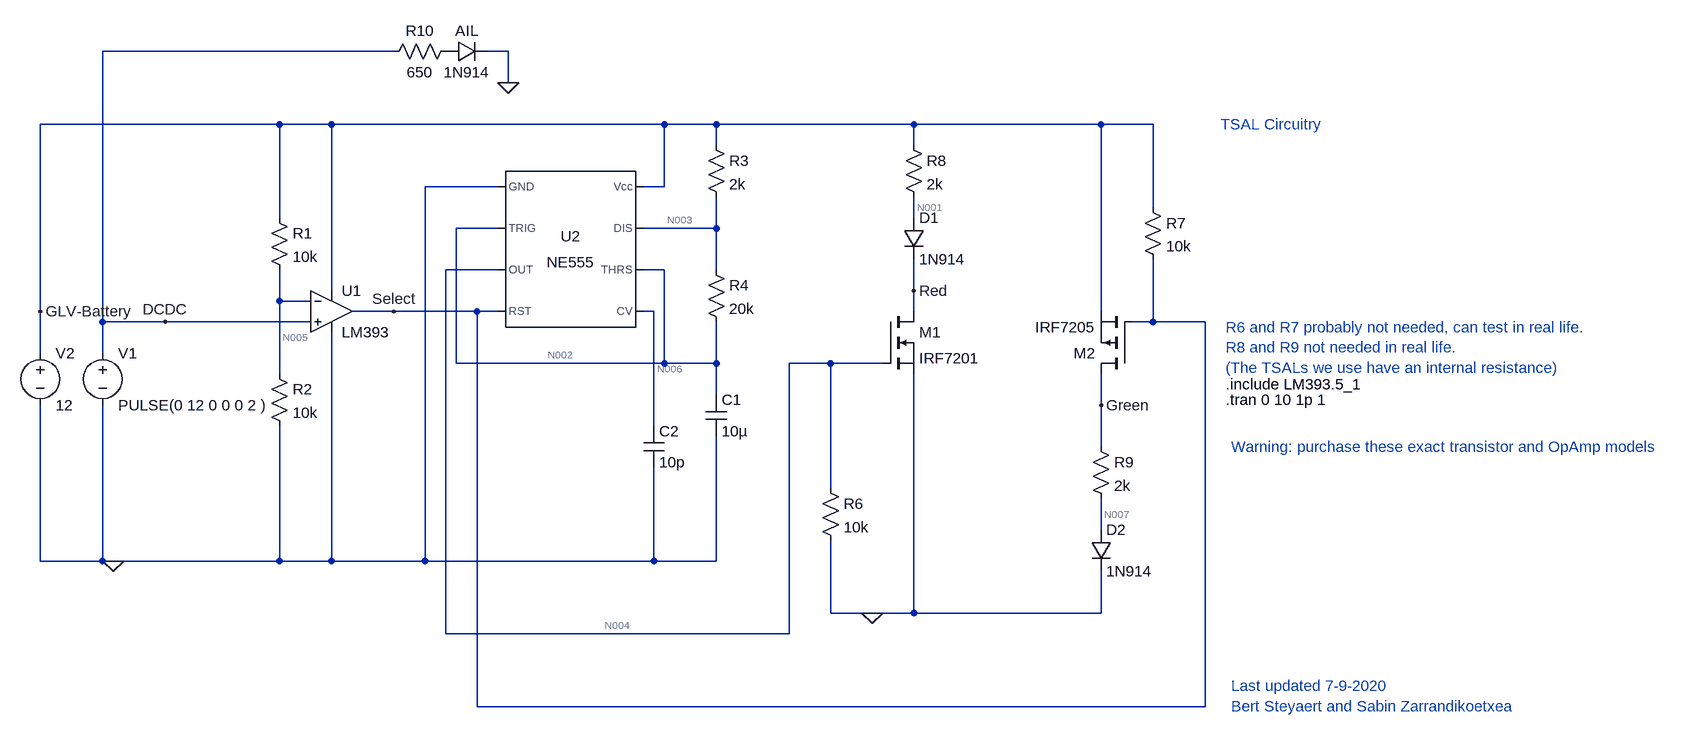
[diagram p0: schematic TSAL AIL.asc]
TSAL AIL.asc, the LTspice schematic file:
Version 4
SHEET 1 2264 780
WIRE 256 -240 -192 -240
WIRE 432 -240 400 -240
WIRE 432 -192 432 -240
WIRE 80 -128 -288 -128
WIRE 160 -128 80 -128
WIRE 672 -128 160 -128
WIRE 752 -128 672 -128
WIRE 1056 -128 752 -128
WIRE 1344 -128 1056 -128
WIRE 1424 -128 1344 -128
WIRE 752 -96 752 -128
WIRE 1056 -96 1056 -128
WIRE 416 -32 304 -32
WIRE 672 -32 672 -128
WIRE 672 -32 640 -32
WIRE 1424 0 1424 -128
WIRE 80 16 80 -128
WIRE 1056 16 1056 -16
WIRE 416 32 352 32
WIRE 752 32 752 -16
WIRE 752 32 640 32
WIRE 416 96 336 96
WIRE 672 96 640 96
WIRE 752 96 752 32
WIRE 160 128 160 -128
WIRE 1056 128 1056 80
WIRE 80 144 80 96
WIRE 128 144 80 144
WIRE -288 160 -288 -128
WIRE 256 160 192 160
WIRE 384 160 256 160
WIRE 416 160 384 160
WIRE 656 160 640 160
WIRE 1056 160 1056 128
WIRE 1344 160 1344 -128
WIRE -192 176 -192 -240
WIRE -96 176 -192 176
WIRE 128 176 -96 176
WIRE 1424 176 1424 80
WIRE 1424 176 1392 176
WIRE 1504 176 1424 176
WIRE -288 224 -288 160
WIRE -192 224 -192 176
WIRE 352 240 352 32
WIRE 672 240 672 96
WIRE 672 240 352 240
WIRE 752 240 752 176
WIRE 752 240 672 240
WIRE 928 240 864 240
WIRE 1008 240 928 240
WIRE 80 256 80 144
WIRE 752 288 752 240
WIRE 1344 304 1344 256
WIRE 656 336 656 160
WIRE 1344 368 1344 304
WIRE 928 432 928 240
WIRE 1344 496 1344 448
WIRE -288 544 -288 304
WIRE -192 544 -192 304
WIRE -192 544 -288 544
WIRE -176 544 -192 544
WIRE 80 544 80 336
WIRE 80 544 -176 544
WIRE 160 544 160 192
WIRE 160 544 80 544
WIRE 304 544 304 -32
WIRE 304 544 160 544
WIRE 656 544 656 400
WIRE 656 544 304 544
WIRE 752 544 752 352
WIRE 752 544 656 544
WIRE 928 624 928 512
WIRE 992 624 928 624
WIRE 1056 624 1056 256
WIRE 1056 624 992 624
WIRE 1344 624 1344 560
WIRE 1344 624 1056 624
WIRE 336 656 336 96
WIRE 864 656 864 240
WIRE 864 656 336 656
WIRE 384 768 384 160
WIRE 1504 768 1504 176
WIRE 1504 768 384 768
FLAG -96 176 DCDC
FLAG -288 160 GLV-Battery
FLAG 992 624 0
FLAG -176 544 0
FLAG 432 -192 0
FLAG 256 160 Select
FLAG 1056 128 Red
FLAG 1344 304 Green
SYMBOL Opamps\\opamp2 160 96 R0
SYMATTR InstName U1
SYMATTR Value LM393
SYMBOL Misc\\NE555 528 64 R0
SYMATTR InstName U2
SYMBOL voltage -192 208 R0
WINDOW 123 0 0 Left 0
WINDOW 39 0 0 Left 0
SYMATTR InstName V1
SYMATTR Value PULSE(0 12 0 0 0 2 )
SYMBOL res 64 0 R0
SYMATTR InstName R1
SYMATTR Value 10k
SYMBOL res 64 240 R0
SYMATTR InstName R2
SYMATTR Value 10k
SYMBOL res 736 -112 R0
SYMATTR InstName R3
SYMATTR Value 2k
SYMBOL res 736 80 R0
SYMATTR InstName R4
SYMATTR Value 20k
SYMBOL cap 736 288 R0
SYMATTR InstName C1
SYMATTR Value 10µ
SYMBOL voltage -288 208 R0
WINDOW 123 0 0 Left 0
WINDOW 39 0 0 Left 0
SYMATTR InstName V2
SYMATTR Value 12
SYMBOL nmos 1008 160 R0
SYMATTR InstName M1
SYMATTR Value IRF7201
SYMBOL res 912 416 R0
SYMATTR InstName R6
SYMATTR Value 10k
SYMBOL pmos 1392 256 R180
SYMATTR InstName M2
SYMATTR Value IRF7205
SYMBOL res 1408 -16 R0
SYMATTR InstName R7
SYMATTR Value 10k
SYMBOL res 1040 -112 R0
SYMATTR InstName R8
SYMATTR Value 2k
SYMBOL res 1328 352 R0
SYMATTR InstName R9
SYMATTR Value 2k
SYMBOL diode 336 -224 R270
WINDOW 0 32 32 VTop 2
WINDOW 3 0 32 VBottom 2
SYMATTR InstName AIL
SYMATTR Value 1N914
SYMBOL res 352 -256 R90
WINDOW 0 0 56 VBottom 2
WINDOW 3 32 56 VTop 2
SYMATTR InstName R10
SYMATTR Value 650
SYMBOL diode 1040 16 R0
SYMATTR InstName D1
SYMATTR Value 1N914
SYMBOL diode 1328 496 R0
SYMATTR InstName D2
SYMATTR Value 1N914
SYMBOL cap 640 336 R0
SYMATTR InstName C2
SYMATTR Value 10p
TEXT 1536 272 Left 2 !.include LM393.5_1
TEXT 1536 296 Left 2 !.tran 0 10 1p 1
TEXT 1536 184 Left 2 ;R6 and R7 probably not needed, can test in real life.\nR8 and R9 not needed in real life.\n(The TSALs we use have an internal resistance)
TEXT 1528 -128 Left 2 ;TSAL Circuitry
TEXT 1544 736 Left 2 ;Last updated 7-9-2020 \nBert Steyaert and Sabin Zarrandikoetxea
TEXT 1544 368 Left 2 ;Warning: purchase these exact transistor and OpAmp models

The netlist it stands for:
* TSAL AIL.asc
XU1 DCDC N005 GLV-Battery 0 Select LM393  ; pins In+ In- V+ V- OUT
XU2 0 N002 N004 Select N006 N002 N003 GLV-Battery NE555  ; pins GND TRIG OUT RST CV THRS DIS Vcc
V1 DCDC 0 PULSE(0 12 0 0 0 2 )
R1 GLV-Battery N005 10k
R2 N005 0 10k
R3 GLV-Battery N003 2k
R4 N003 N002 20k
C1 N002 0 10µ
V2 GLV-Battery 0 12
M1 Red N004 0 0 IRF7201
R6 N004 0 10k
M2 Green Select GLV-Battery GLV-Battery IRF7205
R7 GLV-Battery Select 10k
R8 GLV-Battery N001 2k
R9 Green N007 2k
D§AIL P001 0 1N914
R10 P001 DCDC 650
D1 N001 Red 1N914
D2 N007 0 1N914
C2 N006 0 10p
.model D D
.lib standard.dio
.model NMOS NMOS
.model PMOS PMOS
.lib standard.mos
.include LM393.5_1
.tran 0 10 1p 1
* R6 and R7 probably not needed, can test in real life.
* R8 and R9 not needed in real life.
* (The TSALs we use have an internal resistance)
* TSAL Circuitry
* Last updated 7-9-2020
* Bert Steyaert and Sabin Zarrandikoetxea
* Warning: purchase these exact transistor and OpAmp models
.lib NE555.sub
.backanno
.end

* Results of the author's LTspice run, read from the files saved beside the schematic
* Operating Point, zero values left out:
*   V(glv-battery) = 12 V
*   V(n005) = 6 V
*   V(select) = 74.68 mV
*   V(n002) = 35.89 mV
*   V(n006) = 8 V
*   V(n003) = 35.89 mV
*   V(n004) = 71.96 µV
*   V(red) = 12 V
*   V(green) = 12 V
*   V(n001) = 12 V
*   V(n007) = 666 mV
*   Id(M2) = -5.667 mA
*   Is(M2) = 5.667 mA
*   Id(M1) = 14.37 pA
*   Is(M1) = -14.37 pA
*   I(D2) = 5.667 mA
*   I(D1) = 26.57 pA
*   I(R9) = 5.667 mA
*   I(R8) = 26.57 pA
*   I(R7) = 1.193 mA
*   I(R6) = 7.196 nA
*   I(R4) = 71.78 pA
*   I(R3) = 5.982 mA
*   I(R2) = 600 µA
*   I(R1) = 600 µA
*   I(V2) = -17.91 mA
*   I(V1) = 49.98 nA
*   Ix(u1:1) = -49.98 nA
*   Ix(u1:2) = 11.86 pA
*   Ix(u1:3) = 259.2 µA
*   Ix(u1:4) = -1.852 mA
*   Ix(u1:5) = 1.593 mA
*   Ix(u2:1) = -9.794 mA
*   Ix(u2:2) = 35.89 pA
*   Ix(u2:3) = -7.196 nA
*   Ix(u2:4) = -400 µA
*   Ix(u2:6) = 35.89 pA
*   Ix(u2:7) = 5.982 mA
*   Ix(u2:8) = 4.212 mA
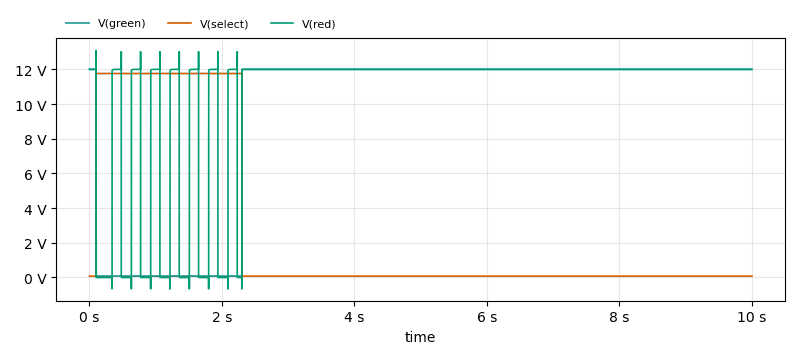
[diagram p1: Transient Analysis of TSAL AIL.asc, plotted from the saved traces]
* Transient Analysis, 1 run:
*   V(green): min -106.5 mV, max 12 V, average 9.377 V, rms 10.6 V, last 12 V
*   V(select): min 74.68 mV, max 11.76 V, average 2.646 V, rms 5.517 V, last 74.68 mV
*   V(red): min -653.9 mV, max 13.09 V, average 10.53 V, rms 11.24 V, last 12 V